# Altium project MeArm.PrjPcb
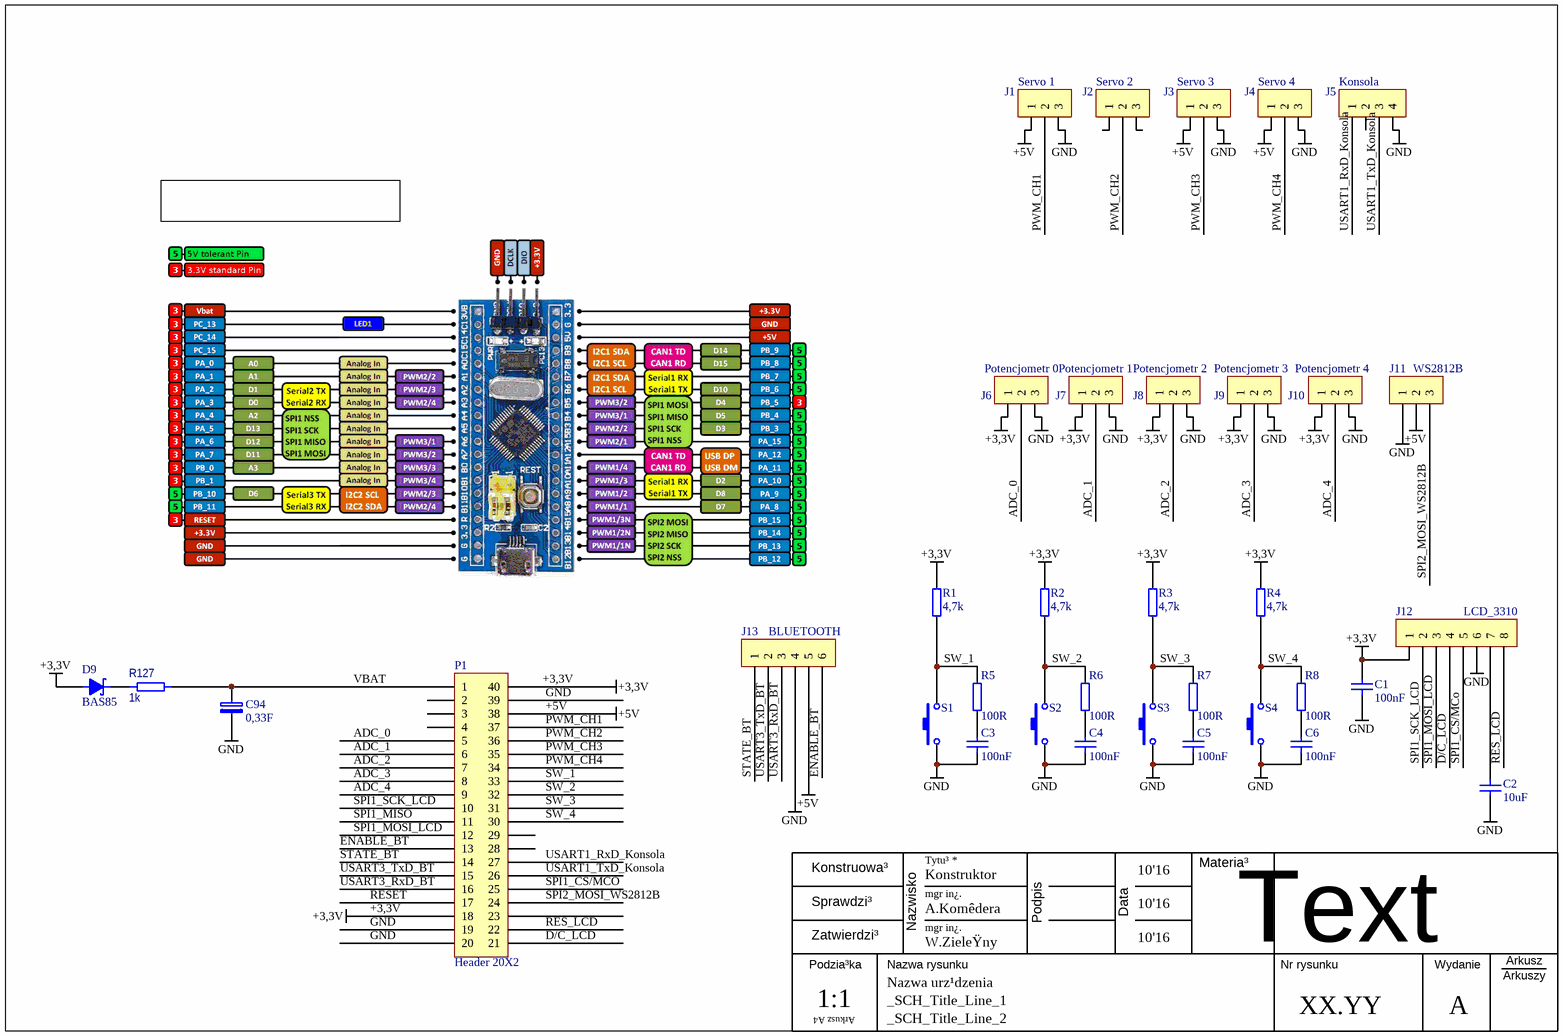
[diagram p0: MeArm.SchDoc]
_ApprovedBy: W.ZieleŸny; _ApprovedByTitle: mgr in¿.; _CheckedBy: A.Komêdera; _CheckedByTitle: mgr in¿.; _Engineer: Konstruktor; _EngineerTitle: Tytu³ *; _GERBER: Nazwa Pliku; _PCB_1_Title: _PCB_1_Title *; _PCB_2_Title: _PCB_2_Title *; _PCB_3_Title: _PCB_3_Title *; _PCB_4_Title: _PCB_4_Title *; _PCB_5_Title: _PCB_5_Title *; _PCB_6_Title: _PCB_6_Title *; _PCB_7_Title: _PCB_7_Title *; _PCB_8_Title: _PCB_8_Title *; _PCB_9_Title: _PCB_9_Title *; _PCB_10_Title: _PCB_10_Title *; _PCB_Date_1: _PCB_Date_1 *; _PCB_Date_2: _PCB_Date_2 *; _PCB_Date_3: _PCB_Date_3 *; _PCB_Date_4: _PCB_Date_4 *; _PCB_Date_5: _PCB_Date_5 *; _PCB_Date_6: _PCB_Date_6 *; _PCB_Date_7: _PCB_Date_7 *; _PCB_Date_8: _PCB_Date_8 *; _PCB_Date_9: _PCB_Date_9 *; _PCB_Date_10: _PCB_Date_10 *; _PCB_Rev_1: _PCB_Rev_1 *; _PCB_Rev_2: _PCB_Rev_2 *; _PCB_Rev_3: _PCB_Rev_3 *; _PCB_Rev_4: _PCB_Rev_4 *; _PCB_Rev_5: _PCB_Rev_5 *; _PCB_Rev_6: _PCB_Rev_6 *; _PCB_Rev_7: _PCB_Rev_7 *; _PCB_Rev_8: _PCB_Rev_8 *; _PCB_Rev_9: _PCB_Rev_9 *; _PCB_Rev_10: _PCB_Rev_10 *; _ProjectName: Nazwa urz¹dzenia; _ProjectNr: XX.YY; _ProjectNr_PCB: XX.YY.B; _Scale: 1:1
1 sheet, 35 parts. Net scope: global (net labels, ports and power ports of the same name join across sheets).
Board file: MeArm.PcbDoc

## Sheet MeArm.SchDoc
size A4; _Scale: 1:1; Date: 10'16; Revision: A; SheetNumber: B; SheetTotal: C; _SCH_Title_Line_2: _SCH_Title_Line_2; _SCH_Title_Line_1: _SCH_Title_Line_1; PageSetup: Record=PageOptions|CenterHorizontal=True|CenterVertical=True|PrintScale=0.96|XCorrection=1.00|YCorrection=1.00|PrintKind=0|BorderSize=5000000|LeftOffset=0|BottomOffset=0|Orientation=2|PaperLength=1000|PaperWidth=1000|Scale=100|PaperSource=7|PrintQuality=-4|MediaType=1|DitherType=10|PaperKind=A4|PrintScaleMode=1

### Parts
C1  100nF  [0603]
C2  10uF  [0603]
C3  100nF  [0603]
C4  100nF  [0603]
C5  100nF  [0603]
C6  100nF  [0603]
C94  0,33F  [kond elektrolit supercap 13x7]
D9  BAS85  [SOD-80 (MINIMELF)]
J1  Servo 1  [z-goldpin 1x3 P 2.54 SMD]
J2  Servo 2  [z-goldpin 1x3 P 2.54 SMD]
J3  Servo 3  [z-goldpin 1x3 P 2.54 SMD]
J4  Servo 4  [z-goldpin 1x3 P 2.54 SMD]
J5  Konsola  [z-goldpin 1x4 P 2.54 SMD]
J6  Potencjometr 0  [z-goldpin 1x3 P 2.54 THT]
J7  Potencjometr 1  [z-goldpin 1x3 P 2.54 THT]
J8  Potencjometr 2  [z-goldpin 1x3 P 2.54 THT]
J9  Potencjometr 3  [z-goldpin 1x3 P 2.54 THT]
J10  Potencjometr 4  [z-goldpin 1x3 P 2.54 THT]
J11  WS2812B  [z-goldpin 1x3 K 2.54 THT]
J12  LCD_3310  [z-goldpin 1x8 P 2.54 THT]
J13  BLUETOOTH  [z-goldpin 1x6 P 2.54 SMD]
P1  Header 20X2  [40P6]
R1  4,7k  [0603]
R2  4,7k  [0603]
R3  4,7k  [0603]
R4  4,7k  [0603]
R5  100R  [0603]
R6  100R  [0603]
R7  100R  [0603]
R8  100R  [0603]
R127  1k  [0805]
S1  przycisk monostabilny  [mikroprzel SMD (TME: TACTM-69N-F)]  (value not drawn)
S2  przycisk monostabilny  [mikroprzel SMD (TME: TACTM-69N-F)]  (value not drawn)
S3  przycisk monostabilny  [mikroprzel SMD (TME: TACTM-69N-F)]  (value not drawn)
S4  przycisk monostabilny  [mikroprzel SMD (TME: TACTM-69N-F)]  (value not drawn)

### Nets
+3,3V: C1.2 D9.1(A) J6.1 J7.1 J8.1 J9.1 J10.1 J12.1 P1.18 P1.40 R1.2 R2.2 R3.2 R4.2
+5V: J1.1 J3.1 J4.1 J11.2 J13.5 P1.38
GND: C1.1 C2.2 C3.1 C4.1 C5.1 C6.1 C94.2 J1.3 J3.3 J4.3 J5.4 J6.3 J7.3 J8.3 J9.3 J10.3 J11.1 J12.6 J13.4 P1.19 P1.20 P1.39 S1.1 S2.1 S3.1 S4.1
ADC_0: J6.2 P1.5
ADC_1: J7.2 P1.6
ADC_2: J8.2 P1.7
ADC_3: J9.2 P1.8
ADC_4: J10.2 P1.9
D/C_LCD: J12.4 P1.21
ENABLE_BT: J13.6 P1.13
PWM_CH1: J1.2 P1.37
PWM_CH2: J2.2 P1.36
PWM_CH3: J3.2 P1.35
PWM_CH4: J4.2 P1.34
RES_LCD: J12.8 P1.22
RESET: P1.17
SPI1_CS/MCo: J12.5 P1.25
SPI1_MISO: P1.11
SPI1_MOSI_LCD: J12.3 P1.12
SPI1_SCK_LCD: J12.2 P1.10
SPI2_MOSI_WS2812B: J11.3 P1.24
STATE_BT: J13.1 P1.14
SW_1: P1.33 R1.1 R5.2 S1.2
SW_2: P1.32 R2.1 R6.2 S2.2
SW_3: P1.31 R3.1 R7.2 S3.2
SW_4: P1.30 R4.1 R8.2 S4.2
USART1_RxD_Konsola: J5.1 P1.27
USART1_TxD_Konsola: J5.3 P1.26
USART3_RxD_BT: J13.3 P1.16
USART3_TxD_BT: J13.2 P1.15
VBAT: C94.1 P1.1 R127.2
NetC2_1: C2.1 J12.7
NetC3_2: C3.2 R5.1
NetC4_2: C4.2 R6.1
NetC5_2: C5.2 R7.1
NetC6_2: C6.2 R8.1
NetD9_2: D9.2(K) R127.1

Not connected (* = marked no-connect by the designer): J2 1 3; J5 2; P1 2 3 4 23 28 29

### Notes on the sheet
- Sprawdzi³
- Konstruowa³
- Podpis
- Data
- Materia³
- Podzia³ka
- Zatwierdzi³
- Nazwa rysunku
- Nazwisko
- Text
- Nr rysunku
- Wydanie
- Arkuszy
- Arkusz
- Arkusz A4

### Library data of the parts
C1-C6 = kondensator: _Dielektryk: /X7R; _Tolerancja: /5%; _Napiecie: /50V; _Nazwa_Czesci: Kondensator; _Obudowa: 0603
  C1 C3-C6: _Wartosc: 100nF
  C2: _Wartosc: 10uF
C94 = CAP POL: _Obudowa: (SUPERCAP); _Napiecie: /5,5V; _Nazwa_Czesci: Kondensator elektrolityczny; _Wartosc: 0,33F
D9 = DIODA SCHOTTKY: Schottky Diode; _Obudowa: (MINIMELF); _Nazwa_Czesci: Dioda Schottky; _Wartosc: BAS85
J1-J4 J6-J11 = zlacze 3pin
  J1: _Nazwa_Czesci: Servo 1; _Obudowa: z-goldpin 1x3 P 2.54 SMD
  J2: _Nazwa_Czesci: Servo 2; _Obudowa: z-goldpin 1x3 P 2.54 SMD
  J3: _Nazwa_Czesci: Servo 3; _Obudowa: z-goldpin 1x3 P 2.54 SMD
  J4: _Nazwa_Czesci: Servo 4; _Obudowa: z-goldpin 1x3 P 2.54 SMD
  J6: _Nazwa_Czesci: Potencjometr 0; _Obudowa: z-goldpin 1x3 P 2.54 THT
  J7: _Nazwa_Czesci: Potencjometr 1; _Obudowa: z-goldpin 1x3 P 2.54 THT
  J8: _Nazwa_Czesci: Potencjometr 2; _Obudowa: z-goldpin 1x3 P 2.54 THT
  J9: _Nazwa_Czesci: Potencjometr 3; _Obudowa: z-goldpin 1x3 P 2.54 THT
  J10: _Nazwa_Czesci: Potencjometr 4; _Obudowa: z-goldpin 1x3 P 2.54 THT
  J11: _Nazwa_Czesci: WS2812B; _Obudowa: z-goldpin 1x3 K 2.54 THT
J5 = zlacze 4pin: _Nazwa_Czesci: Konsola; _Obudowa: z-goldpin 1x4 P 2.54 SMD
J12 = zlacze 8pin: _Nazwa_Czesci: LCD_3310; _Obudowa: z-goldpin 1x8 P 2.54 THT
J13 = zlacze 6pin: _Nazwa_Czesci: BLUETOOTH; _Obudowa: z-goldpin 1x6 P 2.54 SMD
P1 = Header 20X2: Header, 20-Pin, Dual row; LatestRevisionDate: 17-Jul-2002; LatestRevisionNote: Re-released for DXP Platform.; Publisher: Altium Limited
R1-R8 = rezystor: _Moc: /0,25W; _Tolerancja: /1%; _Type: SMD/THT; _Nazwa_Czesci: Rezystor; _Obudowa: 0603
  R1-R4: _Wartosc: 4,7k
  R5-R8: _Wartosc: 100R
R127 = Rezystor SMD: _Obudowa: (0805); _Moc: /0,125W; _Tolerancja: /1%; _Nazwa_Czesci: Rezystor; _Wartosc: 1k
S1-S4 = przycisk monostabilny: Switch, microswitch; _Nazwa_Czesci: Mikroprze³¹cznik SPST-NO; _Wartosc: przycisk monostabilny; _Obudowa: mikroprzel SMD (TME: TACTM-69N-F)